# EAGLE design SAMD11C_Mini_Breakout (EAGLE 9.1.0)
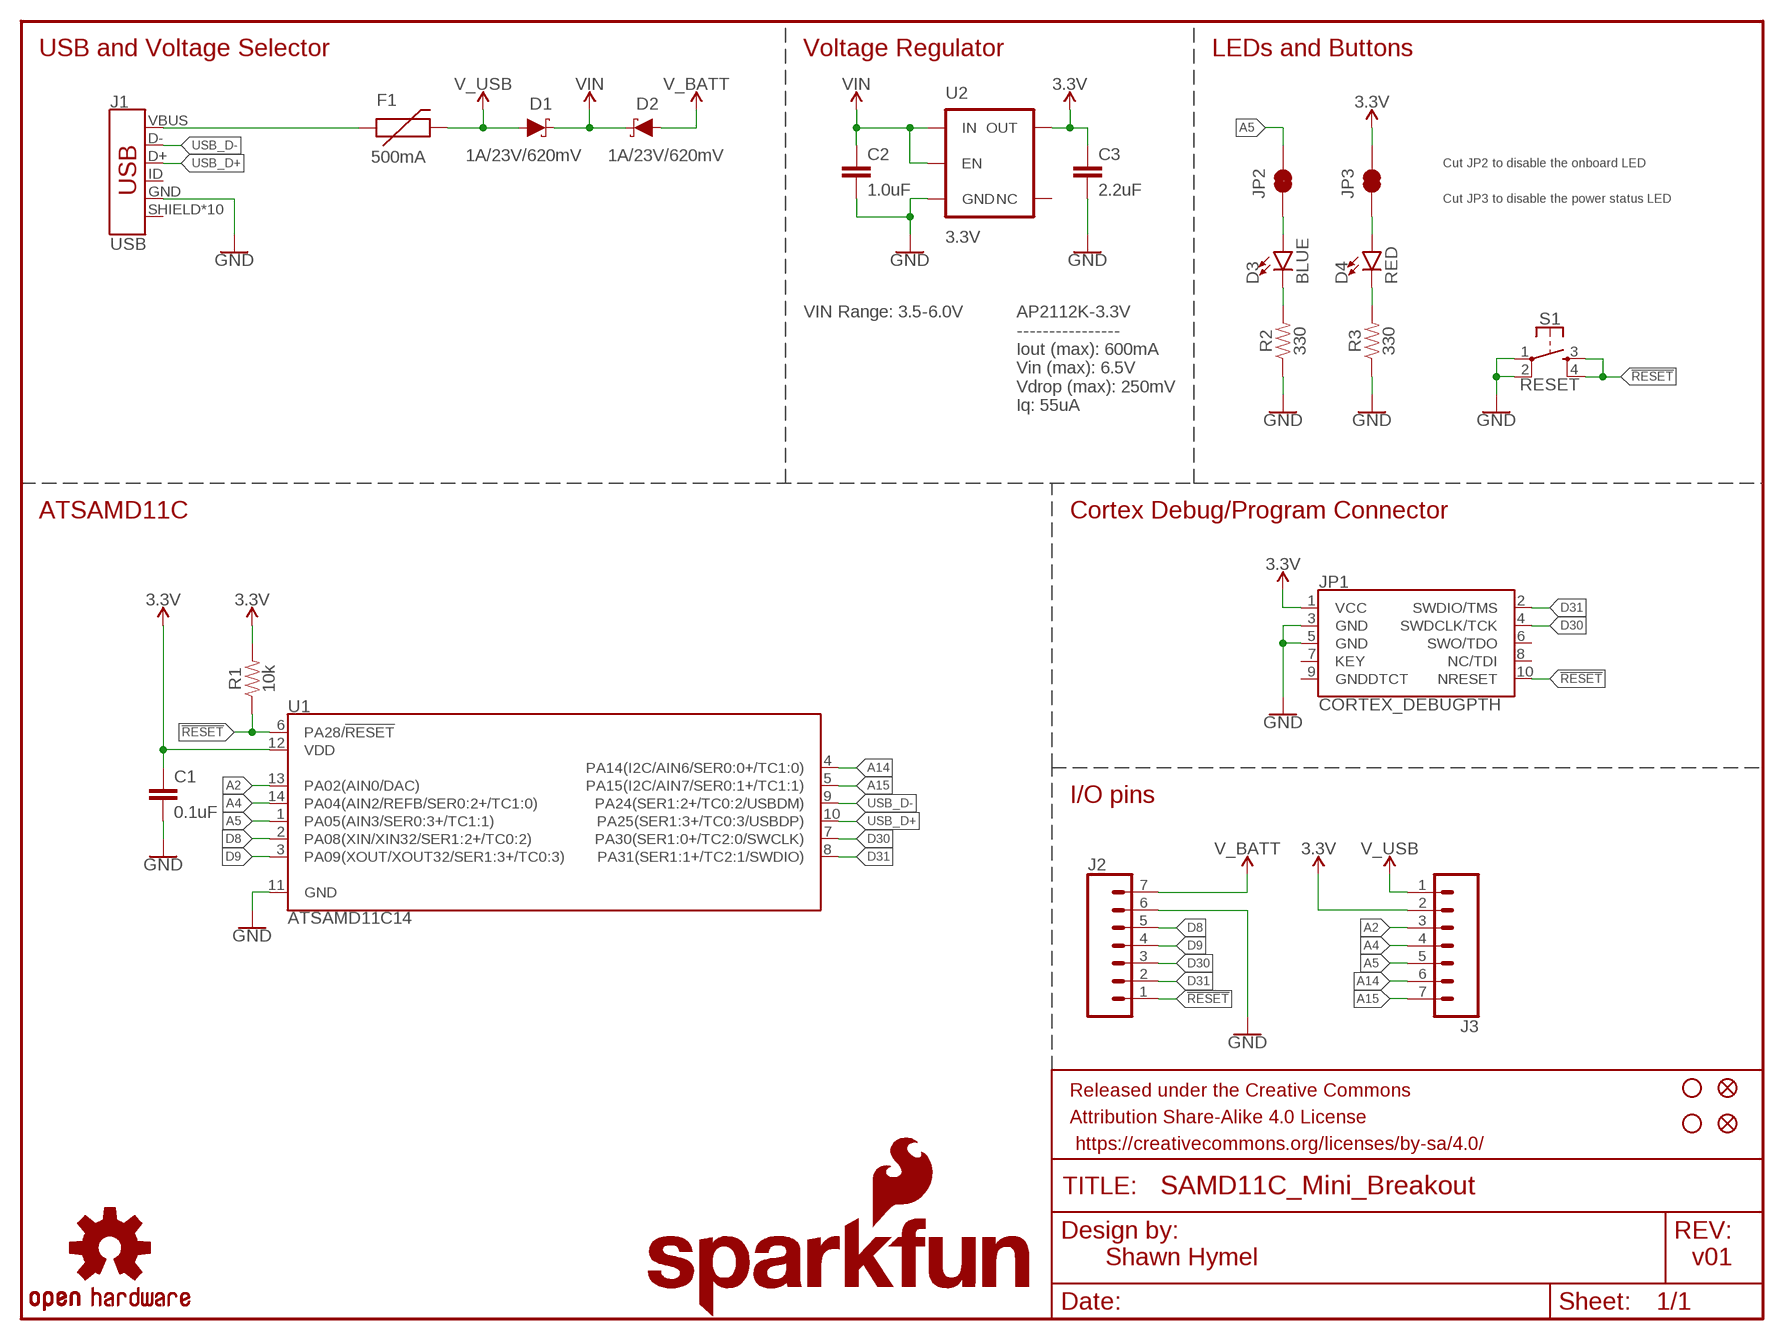
[diagram p0: schematic, sheet 1]

## Parts
C1  0.1uF  0.1UF-0603-25V-(+80/-20%)  [0603]
C2  1.0uF  1.0UF-0805-25V-(+80/-20%)  [0805]
C3  2.2uF  2.2UF-0603-10V-20%  [0603]
D1  1A/23V/620mV  DIODE-SCHOTTKY-BAT20J  [SOD-323]
D2  1A/23V/620mV  DIODE-SCHOTTKY-BAT20J  [SOD-323]
D3  BLUE  LED-BLUE0603  [LED-0603]
D4  RED  LED-RED0603  [LED-0603]
F1  500mA  PTCSMD  [PTC-1206]
FD1  FIDUCIAL1X2  [FIDUCIAL-1X2]
FD2  FIDUCIAL1X2  [FIDUCIAL-1X2]
FRAME1  FRAME-LETTER  [CREATIVE_COMMONS]
FRAME2  FRAME-LETTER  [CREATIVE_COMMONS]
H3  STAND-OFF  [STAND-OFF]
H4  STAND-OFF  [STAND-OFF]
J1  USB  USB_MICRO-B_HALF_PTH_MILL  [USB-MICROB-PTH-MILL]
J2  CONN_07NO_SILK  [1X07_NO_SILK]
J3  CONN_07NO_SILK  [1X07_NO_SILK]
JP1  CORTEX_DEBUGPTH  [2X5-PTH-1.27MM]
JP2  JUMPER-SMT_2_NC_TRACE_NO-SILK  [SMT-JUMPER_2_NC_TRACE_NO-SILK]
JP3  JUMPER-SMT_2_NC_TRACE_NO-SILK  [SMT-JUMPER_2_NC_TRACE_NO-SILK]
LOGO1  OSHW-LOGOS  [OSHW-LOGO-S]
LOGO2  SFE_LOGO_NAME_FLAME.1_INCH  [SFE_LOGO_NAME_FLAME_.1]
LOGO3  SFE_LOGO_FLAME.1_INCH  [SFE_LOGO_FLAME_.1]
R1  10k  10KOHM-0603-1/10W-1%  [0603]
R2  330  330OHM-0603-1/10W-1%  [0603]
R3  330  330OHM-0603-1/10W-1%  [0603]
S1  RESET  MOMENTARY-SWITCH-SPST-2-SMD-4.6X2.8MM  [TACTILE_SWITCH_SMD_4.6X2.8MM]
U1  ATSAMD11C14  [SOIC-14]
U2  3.3V  V_REG_AP2112K-3.3V  [SOT23-5]

## Nets
3.3V: C1.1 C3.1 J3.2 JP1.1(VCC) JP3.2 R1.2 U1.12(VDD) U2.5(OUT)
!RESET: J2.1 JP1.10(NRESET) R1.1 S1.3 S1.4 U1.6(PA28/!RESET!)
A2: J3.3 U1.13(PA02(AIN0/DAC))
A4: J3.4 U1.14(PA04(AIN2/REFB/SER0:2+/TC1:0))
A5: J3.5 JP2.2 U1.1(PA05(AIN3/SER0:3+/TC1:1))
A14: J3.6 U1.4(PA14(I2C/AIN6/SER0:0+/TC1:0))
A15: J3.7 U1.5(PA15(I2C/AIN7/SER0:1+/TC1:1))
D8: J2.5 U1.2(PA08(XIN/XIN32/SER1:2+/TC0:2))
D9: J2.4 U1.3(PA09(XOUT/XOUT32/SER1:3+/TC0:3))
D30: J2.3 JP1.4(SWDCLK/TCK) U1.7(PA30(SER1:0+/TC2:0/SWCLK))
D31: J2.2 JP1.2(SWDIO/TMS) U1.8(PA31(SER1:1+/TC2:1/SWDIO))
GND: C1.2 C2.2 C3.2 J1.GND J2.6 JP1.3(GND) JP1.5(GND) R2.1 R3.1 S1.1 S1.2 U1.11(GND) U2.2(GND)
N$1: D3.A JP2.1
N$2: D3.C R2.2
N$3: D4.A JP3.1
N$4: F1.1 J1.VBUS
N$5: D4.C R3.2
USB_D+: J1.D+ U1.10(PA25(SER1:3+/TC0:3/USBDP))
USB_D-: J1.D- U1.9(PA24(SER1:2+/TC0:2/USBDM))
V_BATT: D2.A J2.7
V_USB: D1.A F1.2 J3.1
VIN: C2.1 D1.C D2.C U2.1(IN) U2.3(EN)
Unconnected: J1.ID J1.SHIELD J1.SHIELD2(SHIELD) J1.SHIELD3(SHIELD) J1.SHIELD4(SHIELD) J1.SHIELD5(SHIELD) J1.SHIELD6(SHIELD) J1.SHIELD7(SHIELD) J1.SHIELD8(SHIELD) J1.SHIELD9(SHIELD) J1.SHIELD10(SHIELD) JP1.6(SWO/TDO) JP1.7(KEY) JP1.8(NC/TDI) JP1.9(GNDDTCT) U2.4(NC)

## Notes on the sheet
- USB and Voltage Selector | Voltage Regulator | LEDs and Buttons
- Cut JP2 to disable the onboard LED
- Cut JP3 to disable the power status LED
- VIN Range: 3.5-6.0V
- AP2112K-3.3V
  ----------------
  Iout (max): 600mA 
  Vin (max): 6.5V
  Vdrop (max): 250mV
  Iq: 55uA
- ATSAMD11C | Cortex Debug/Program Connector
- I/O pins
- Shawn Hymel | v01

## Library data of the parts
C1 = SparkFun-Capacitors:0.1UF: 0.1µF ceramic capacitors A capacitor is a passive two-terminal electrical component used to store electrical energy temporarily in an electric field.; PROD_ID: CAP-00810
C2 = SparkFun-Capacitors:1.0UF: 1µF ceramic capacitors A capacitor is a passive two-terminal electrical component used to store electrical energy temporarily in an electric field.; PROD_ID: CAP-11625
C3 = SparkFun-Capacitors:2.2UF: 2.2µF ceramic capacitors A capacitor is a passive two-terminal electrical component used to store electrical energy temporarily in an electric field.; PROD_ID: CAP-07888
D1 D2 = SparkFun-DiscreteSemi:DIODE-SCHOTTKY: Schottky diode A Schottky diode is a semiconductor diode which has a low forward voltage drop and a very fast switching action.; PROD_ID: DIO-11623
D3 = SparkFun-LED:LED-BLUE: Blue SMD LED Used in manufacturing of various products at SparkFun Packages: 0603 - SMD 0603 package [Product Link] <http://www.digikey.com/product-detail/en/SMLE12BC7TT86/511-1589-2-ND/1641808> 1206 - SMD1206 package [Product Link] <http://www.digikey.com/product-detail/en/lite-on-inc/LTST-C150TBKT/160-1643-1-ND/573584> SparkFun Products: ESP8266 Thing-Dev Board <https://www.sparkfun.com/products/13711> RedBoard <https://www.sparkfun.com/products/12757>; PROD_ID: DIO-08575
D4 = SparkFun-LED:LED-RED: Red SMD LED Used in manufacturing of most products at SparkFun Packages: 0603 - SMD 0603 package [Product Link] <http://docs.avagotech.com/docs/AV02-0551EN> 0603 SMART - SMD 0603 SMART package ( more efficient and expensive)[Product Link] <http://www.osram-os.com/Graphics/XPic2/00077099_0.pdf> 1206 - SMD1206 package [Product Link] <https://www.sparkfun.com/datasheets/DevTools/LilyPad/Q150OVS4.pdff> SparkFun Products: Pro Mini 328 -5V <https://www.sparkfun.com/products/821> RedBoard <https://www.sparkfun.com/products/12757> IOIO-OTG <https://www.sparkfun.com/products/13613>; PROD_ID: DIO-00819
F1 = SparkFun-PowerIC:PTC: Resettable Fuse PTC Resettable Fuse. Spark Fun Electronics SKU : COM-08357; PROD_ID: RES-11150
FD1 FD2 = SparkFun-Aesthetics:FIDUCIAL: Fiducial Alignment Points Point-of-reference for pick-and-place machines and other optical instruments.
FRAME1 FRAME2 = SparkFun-Aesthetics:FRAME-LETTER: Schematic Frame - Letter Standard 8.5x11 US Letter frame
H3 H4 = SparkFun-Hardware:STAND-OFF: Stand Off Drill holes for mechanically mounting via screws, standoffs, etc. Note: Use the keepout ring to avoid running the screw head into surrounding components. Variant Overviews STAND-OFF - Mechanical footprint for a #4 phillips button head screw. STAND-OFF-TIGHT - Mechanical footprint for a #4 phillips button head screw, Example SparkFun Products Screw - Phillips Head (1/4", 4-40, 10 pack) <https://www.sparkfun.com/products/10453> (PRT-10453) Screw - Phillips Head (1/2", 4-40, 10 pack) <https://www.sparkfun.com/products/10452> (PRT-10452) Screw - Phillips Head (3/4", 4-40, 10 pack) <https://www.sparkfun.com/products/10451> (PRT-10451) Screw - Phillips Head (1", 4-40, 10 pack) <https://www.sparkfun.com/products/10450> (PRT-10450)
J1 = SparkFun-Connectors:USB_MICRO-B: USB Type Micro-B Connector Male/female and PTH/SMT variants SparkFun Products: SparkFun microB USB Breakout <https://www.sparkfun.com/products/12035> SparkFun USB microB Plug Breakout <https://www.sparkfun.com/products/10031> SparkFun ESP8266 Thing <https://www.sparkfun.com/products/13231>; PROD_ID: CONN-13711
J2 J3 = SparkFun-Connectors:CONN_07: Multi connection point. Often used as Generic Header-pin footprint for 0.1 inch spaced/style header connections On any of the 0.1 inch spaced packages, you can populate with these: Break Away Headers - Straight <https://www.sparkfun.com/products/116> (PRT-00116) Break Away Male Headers - Right Angle <https://www.sparkfun.com/products/553> (PRT-00553) Female Headers <https://www.sparkfun.com/products/115> (PRT-00115) Break Away Headers - Machine Pin <https://www.sparkfun.com/products/117> (PRT-00117) Break Away Female Headers - Swiss Machine Pin <https://www.sparkfun.com/products/743> (PRT-00743) For SCREWTERMINALS and SPRING TERMINALS visit here: Screw Terimnals on SparkFun.com <https://www.sparkfun.com/search/results?term=Screw+Terminals> (5mm/3.5mm/2.54mm spacing) This device is also useful as a general connection point to wire up your design to another part of your project. Our various solder wires solder well into these plated through hole pads. Hook-Up Wire - Assortment (Stranded, 22 AWG) <https://www.sparkfun.com/products/11375> (PRT-11375) Hook-Up Wire - Assortment (Solid Core, 22 AWG) <https://www.sparkfun.com/products/11367> (PRT-11367) View the entire wire category on our website here <https://www.sparkfun.com/categories/141> Special notes: Molex polarized connector foot print use with SKU : PRT-08231 with associated crimp pins and housings. 1MM SMD Version SKU: PRT-10208 NOTES ON THE VARIANTS LOCK and LOCK_LONGPADS... This footprint was designed to help hold the alignment of a through-hole component (i.e. 6-pin header) while soldering it into place. You may notice that each hole has been shifted either up or down by 0.005 of an inch from it's more standard position (which is a perfectly straight line). This slight alteration caused the pins (the squares in the middle) to touch the edges of the holes. Because they are alternating, it causes a "brace" to hold the component in place. 0.005 has proven to be the perfect amount of "off-center" position when using our standard breakaway headers. Although looks a little odd when you look at the bare footprint, once you have a header in there, the alteration is very hard to notice. Also,if you push a header all the way into place, it is covered up entirely on the bottom side.
JP1 = samd21-temp:CORTEX_DEBUG: Cortex Debug Connector Datasheet <http://infocenter.arm.com/help/topic/com.arm.doc.faqs/attached/13634/cortex_debug_connectors.pdf>
JP2 JP3 = SparkFun-Jumpers:JUMPER-SMT_2_NC_TRACE: Normally closed trace jumper This jumper has a trace between two pads so it's normally closed (NC). Use a razor knife to open the connection. For best results follow the IPC guidelines for cutting traces: Cutout at least 0.063 mm (0.005 in). Remove all loose material to clean up the cut area. Seal the cut with an approved epoxy. Reapply solder to reclose the connection.
LOGO1 = SparkFun-Aesthetics:OSHW-LOGO: Open-Source Hardware (OSHW) Logo This logo indicates the piece of hardware it is found on incorporates a OSHW license and/or adheres to the definition of open source hardware found here: http://freedomdefined.org/OSHW
LOGO2 = SparkFun-Aesthetics:SFE_LOGO_NAME_FLAME: SparkFun Font Logo w/ Flame This is the SparkFun full logo. The logo on the schematic will always be the same size; the package variant is the height of the flame part of the logo. Default layer for the logo on the board is tSilk.
LOGO3 = SparkFun-Aesthetics:SFE_LOGO_FLAME: SparkFun Flame Logo This is the SparkFun flame logo. The logo on the schematic will always be the same size; the package variant is the height of the flame. Default layer for the logo on the board is tSilk.
R1 = SparkFun-Resistors:10KOHM: 10kΩ resistor A resistor is a passive two-terminal electrical component that implements electrical resistance as a circuit element. Resistors act to reduce current flow, and, at the same time, act to lower voltage levels within circuits. - Wikipedia; PROD_ID: RES-00824
R2 R3 = SparkFun-Resistors:330OHM: 330Ω resistor A resistor is a passive two-terminal electrical component that implements electrical resistance as a circuit element. Resistors act to reduce current flow, and, at the same time, act to lower voltage levels within circuits. - Wikipedia; PROD_ID: RES-00818
S1 = SparkFun-Switches:MOMENTARY-SWITCH-SPST-2: Momentary Switch (Pushbutton) - SPST - Two Circuits Normally-open (NO) SPST momentary switches (buttons, pushbuttons). Schematic symbol includes two switch circuits. Variants SMD-4.6MMX2.8MM - 4.60mm x 2.80mm Tactile Momentary Button Switch - Used on SparkFun SAMD21 Mini Breakout <https://www.sparkfun.com/products/13664> SMD-5.2MM - Mini Pushbutton Switch - SMD <https://www.sparkfun.com/products/8720> - Used on Arduino Pro Mini <https://www.sparkfun.com/products/11114>; PROD_ID: SWCH-13065
U1 = SAMD11C14_Mini_Breakout:ATSAMD11C14: Atmel SAM D11 SMART ARM-Based Microcontroller The Atmel® | SMART™ SAM D11 is a series of low-power microcontrollers using the 32-bit ARM® Cortex®-M0+ processor, and ranging from 14- to 24-pins with 16KB Flash and 4KB of SRAM. The SAM D11 devices operate at a maximum frequency of 48MHz and reach 2.46 Coremark/MHz. They are designed for simple and intuitive migration with identical peripheral modules, hex compatible code, identical linear address map and pin compatible migration paths between all devices in the product series. All devices include intelligent and flexible peripherals, Atmel Event System for inter-peripheral signaling, and support for capacitive touch button, slider and wheel user interfaces. The SAM D11 series is compatible to the other product series in the SAM D family, enabling easy migration to larger device with added features.
U2 = SparkFun-PowerIC:V_REG_AP2112: AP2112 - 600mA CMOS LDO Regulator w/ Enable The AP2112 is CMOS process low dropout linear regulator with enable function, the regulator delivers a guaranteed 600mA (min.) continuous load current. Features Output Voltage Accuracy: ±1.5% Output Current: 600mA (Min.) Foldback Short Current Protection: 50mA Enable Function to Turn ON/OFF VOUT Low Dropout Voltage (3.3V): 250mV (Typ.) @IOUT=600mA Excellent Load Regulation: 0.2%/A (Typ.) Excellent Line Regulation: 0.02%/V (Typ.) Low Quiescent Current: 55μA (Typ.) Low Standby Current: 0.01μA (Typ.) Low Output Noise: 50μVRMS PSRR: 100Hz -65dB, 1kHz -65dB OTSD Protection Stable with 1.0μF Flexible Cap: Ceramic, Tantalum and Aluminum Electrolytic Operation Temperature Range: -40°C to 85°C ESD: MM 400V, HBM 4000V; PROD_ID: VREG-12457

## Board
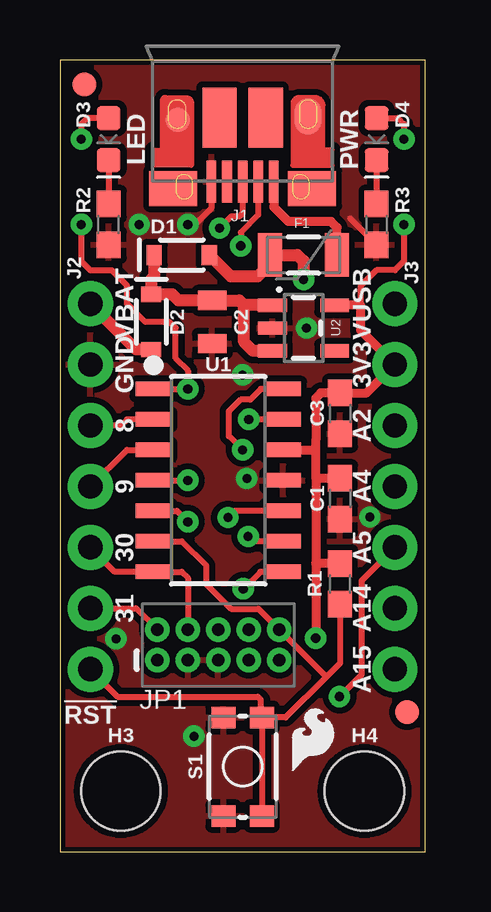
[diagram p1: board, top side]
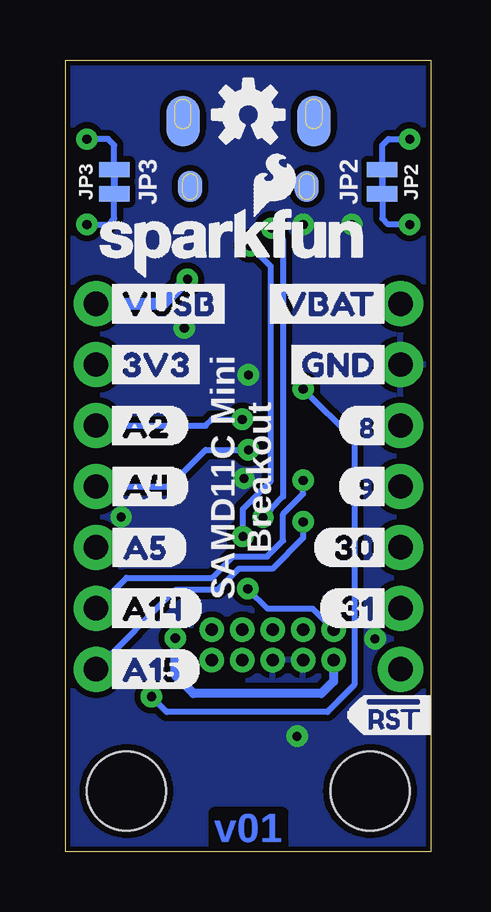
[diagram p2: board, bottom side, seen from below]

Size 15.24 x 33.02 mm. Coordinates in mm from the lower left corner, seen from the top.
Outline: 0,0 15.24,0 15.24,33.02 0,33.02 0,0
Copper layers (1*16): Top 0.035mm / dielectric 1.5mm / Bottom 0.035mm
Design rules "SparkFun-2-layer-STANDARD": minimum track width 10mil, minimum drill 20mil, track to track 10mil, track to pad 8mil, pad to pad 8mil, via to via 10mil, smd to smd 8mil, copper to edge 8mil, drill to drill 8mil, minimum pad ring 10mil, minimum via ring 10mil, stop-mask expansion 4mil, vias tented up to drill 25mil, thermal gap 10mil

### Footprints (pad centres in the part's own frame; a part is rotated, then mirrored left to right if it is on the bottom)
0603 = smd 1.1 x 1: 1 -0.85,0; 2 0.85,0
0805 = smd 0.8 x 1.2: 1 -0.9,0; 2 0.9,0
SOD-323 = smd 0.63 x 0.83: A 1.15,0; C -1.15,0
LED-0603 = smd 1 x 1: A -0.877,0; C 0.877,0
PTC-1206 = smd 1 x 1.8: 1 -1.4,0; 2 1.4,0
FIDUCIAL-1X2 = smd 1 x 1: 1 0,0
STAND-OFF = hole 3.302: 0,0
USB-MICROB-PTH-MILL = smd 0.4 x 1.75: D+ 0,0; D- -0.65,0; GND 1.3,0; ID 0.65,0; VBUS -1.3,0 | smd 2 x 1.46: SHIELD -2.9,0.275; SHIELD2 2.9,0.275 | smd 1.425 x 2.5: SHIELD3 -0.963,-2.675; SHIELD4 0.963,-2.675 | smd 1.4 x 2.1 bottom: SHIELD5 -2.731,-2.531; SHIELD7 2.729,-2.531 | smd 1 x 1: SHIELD6 2.7,-2.575 | smd 1.1 x 1.5: SHIELD8 -2.731,-2.731 | smd 1 x 1.3 bottom: SHIELD9 -2.43,0.195; SHIELD10 2.43,0.195
1X07_NO_SILK = drill 1.016 pad 1.88: 1 0,0; 2 2.54,0; 3 5.08,0; 4 7.62,0; 5 10.16,0; 6 12.7,0; 7 15.24,0
2X5-PTH-1.27MM = drill 0.508 pad 1: 1 -2.54,-0.635; 2 -2.54,0.635; 3 -1.27,-0.635; 4 -1.27,0.635; 5 0,-0.635; 6 0,0.635; 7 1.27,-0.635; 8 1.27,0.635; 9 2.54,-0.635; 10 2.54,0.635
SMT-JUMPER_2_NC_TRACE_NO-SILK = smd 0.635 x 1.27: 1 -0.508,0; 2 0.508,0
TACTILE_SWITCH_SMD_4.6X2.8MM = smd 0.9 x 1: 1 -2.05,-0.8; 2 2.05,-0.8; 3 2.05,0.8; 4 -2.05,0.8
SOIC-14 = smd 0.6 x 1.5: 1 -3.81,-2.7; 2 -2.54,-2.7; 3 -1.27,-2.7; 4 0,-2.7; 5 1.27,-2.7; 6 2.54,-2.7; 7 3.81,-2.7; 8 3.81,2.7; 9 2.54,2.7; 10 1.27,2.7; 11 0,2.7; 12 -1.27,2.7; 13 -2.54,2.7; 14 -3.81,2.7
SOT23-5 = smd 0.55 x 1.2: 1 -0.95,-1.3; 2 0,-1.3; 3 0.95,-1.3; 4 0.95,1.3; 5 -0.95,1.3

### Placement (x,y rotation side)
C1  11.68,14.73 270 top
C2  6.35,22.1 270 top
C3  11.68,18.29 270 top
D1  5.08,24.89 0 top
D2  3.81,22.1 270 top
D3  2.03,29.72 270 top
D4  13.21,29.72 270 top
F1  10.16,24.89 180 top
FD1  14.48,5.84 0 top
FD2  1.02,32 0 top
FRAME1  -17.53,-11.18 0 top  (outside the outline)
FRAME2  -17.53,-11.18 0 top  (outside the outline)
H3  2.54,2.54 0 top
H4  12.7,2.54 0 top
J1  7.62,27.94 180 top
J2  1.27,7.62 90 top
J3  13.97,22.86 270 top
JP1  6.6,8.64 0 top
JP2  2.03,27.94 270 bottom
JP3  13.21,27.94 270 bottom
LOGO1  7.62,30.73 0 bottom
LOGO2  14.22,23.88 0 bottom
LOGO3  9.4,3.05 0 top
R1  11.68,11.18 90 top
R2  2.03,26.16 90 top
R3  13.21,26.16 90 top
S1  7.62,3.56 270 top
U1  6.6,15.49 270 top
U2  10.16,21.84 270 top
U$1  [#RST4]  3.73,5.71 0 bottom
U$2  [3V33]  13.82,20.32 0 bottom
U$3  [85]  3.94,17.78 0 bottom
U$4  [96]  4.06,15.24 0 bottom
U$5  [307]  4.98,12.7 0 bottom
U$6  [318]  4.7,10.16 0 bottom
U$7  [A29]  13.82,17.78 0 bottom
U$8  [A410]  13.77,15.24 0 bottom
U$9  [A511]  13.77,12.7 0 bottom
U$10  [A1412]  13.82,10.16 0 bottom
U$11  [A1513]  13.82,7.62 0 bottom
U$12  [GND1]  6.3,20.32 0 bottom
U$13  [VBAT0]  7.19,22.86 0 bottom
U$14  [VUSB2]  13.82,22.86 0 bottom

### Tracks (layer width: path | path; a pad name or v marks a point on that pad's centre or on a via)
3.3V  (via drill 0.38)
  Top 0.254: v14.35,26.16 14.35,24.64 13.97,24.26 13.21,24.26 12.54,23.59 12.54,22.79
  Top 0.381: 10.67,16.76 10.67,17.17 10.67,18.92 10.88,19.14 C3.1 12.79,19.14 J3.2 12.55,21.74 12.55,22.78 12.54,22.79 U2.5 | U1.12 10.67,16.76 | 10.67,15.6 10.67,16.76 | C1.1 10.68,15.58 10.67,15.6 | 10.67,15.6 10.67,12.04 10.68,12.03 | R1.2 10.68,12.03 | 10.68,12.03 10.67,12.01 v10.67,8.91
  Bottom 0.254: v14.35,26.16 13.46,26.16 13.21,26.42 JP3.2
  Bottom 0.381: JP1.1 4.06,7.11 4.57,6.6 9.91,6.6 10.67,7.37 v10.67,8.91
!RESET
  Top 0.254: S1.4 9.42,5.61 11.11,7.3 | S1.4 S1.3 | U1.6 5.08,12.95 6.1,11.94 6.1,11.18 7.14,10.13 8.28,10.13 JP1.10 11.11,7.3 | 11.11,7.3 11.68,7.87 R1.1 | J2.1 2.41,6.48 8.26,6.48 8.38,6.35 8.38,5.64 S1.4
A2  (via drill 0.38)
  Top 0.254: U1.13 v7.87,18.03
  Bottom 0.254: J3.3 9.4,17.78 9.14,18.03 v7.87,18.03
A4  (via drill 0.38)
  Top 0.254: U1.14 8.38,19.3 7.94,18.86 7.53,18.86 7.05,18.38 7.05,17.34 v7.62,16.76
  Bottom 0.254: J3.4 10.92,15.24 9.4,16.76 v7.62,16.76
A5  (via drill 0.38)
  Top 0.254: U1.1 v5.33,19.3 5.33,20.07 4.83,20.57 4.83,21.84 4.57,22.1 3.56,22.1 2.79,22.86 2.79,23.62 2.16,24.26 1.27,24.26 0.89,24.64 v0.89,26.16 | J3.5 12.57,11.3 12.57,7.39 v11.66,6.48
  Bottom 0.254: v5.33,19.3 3.2,17.17 3.2,6.96 4.32,5.84 11.02,5.84 v11.66,6.48 | v0.89,26.16 1.78,26.16 2.03,26.42 JP2.2
A14  (via drill 0.38)
  Top 0.254: U1.4 v5.33,15.49
  Bottom 0.254: J3.6 12.7,11.43 9.14,11.43 8.26,12.32 6.83,12.32 6.17,12.98 6.17,14.1 5.33,14.94 v5.33,15.49
A15  (via drill 0.38)
  Top 0.254: U1.5 4.88,14.22 v5.33,13.77
  Bottom 0.254: J3.7 10.67,10.92 8.91,10.92 8.03,11.81 6.62,11.81 5.33,13.1 v5.33,13.77
D8
  Top 0.254: U1.2 2.79,18.03 2.54,17.78 J2.5
D9
  Top 0.254: J2.4 2.79,16.76 U1.3
D30
  Top 0.254: JP1.4 5.33,11.43 5.08,11.68 U1.7 2.29,11.68 J2.3
D31  (via drill 0.38)
  Top 0.254: J2.2 3.17,10.16 JP1.2 | U1.8 8.36,11.68 v7.64,10.97
  Bottom 0.254: JP1.2 4.93,10.13 6.81,10.13 v7.64,10.97
GND  (via drill 0.38)
  Top 0.254: J1.GND 6.32,26.84 5.64,26.16 v5.33,26.16 | R3.1 12.1,26.42
  other vias: 7.8,15.57 7.62,19.89 10.29,21.84 3.3,26.16 5.59,4.83 2.34,8.89 12.93,13.97
  pour Bottom: 0,33.02 15.24,33.02 15.24,0 0,0
  pour Top: 0,33.02 15.24,33.02 15.24,0 0,0
N$1  (via drill 0.38)
  Top 0.254: D3.A 1.13,30.59 0.89,30.35 v0.89,29.72
  Bottom 0.254: JP2.1 2.03,29.46 1.78,29.72 v0.89,29.72
N$2
  Top 0.254: D3.C R2.2
N$3  (via drill 0.38)
  Top 0.254: D4.A 14.11,30.59 14.35,30.35 v14.35,29.72
  Bottom 0.254: JP3.1 13.21,29.46 13.46,29.72 v14.35,29.72
N$4
  Top 0.381: J1.VBUS 8.92,26.89 9.53,26.29 11.3,26.29 11.56,26.03 F1.1
N$5
  Top 0.254: D4.C R3.2
USB_D+  (via drill 0.38)
  Top 0.254: v6.66,26.01 7.14,26.49 7.49,26.49 7.62,26.63 J1.D+ | v7.01,13.95 7.29,14.22 U1.10
  Bottom 0.254: v6.66,26.01 6.17,25.53 6.17,15.46 6.17,14.81 6.68,14.31 6.68,14.28 v7.01,13.95
USB_D-  (via drill 0.38)
  Top 0.254: v7.54,25.27 7.54,25.83 8.27,26.56 J1.D- | U1.9 8.05,12.95 v7.85,13.16
  Bottom 0.254: v7.54,25.27 6.68,24.41 6.68,15.47 7.85,14.3 v7.85,13.16
V_BATT
  Top 0.508: D2.A 3.18,20.95 J2.7
V_USB  (via drill 0.38)
  Top 0.508: D1.A 7.12,24 8.26,24 8.76,24.51 F1.2 9.91,24.89 10.16,24.64 v10.16,23.88
  Bottom 0.508: v10.16,23.88 11.18,22.86 J3.1
VIN
  Top 0.508: D1.C 3.93,24 3.81,23.88 D2.C 4.69,23.25 4.94,23 C2.1 7.48,23 7.69,22.79 | U2.1 7.69,22.79 | 7.69,22.79 7.69,21.27 8.06,20.89 U2.3

### Text on the board
Bottom: v01
tPlace: LED | PWR | VBAT | VUSB | GND | 3V3 | 8 | A2 | 9 | A4 | 30 | A5 | 31 | A14 | A15 | !RST
bPlace: JP2 | JP3 | SAMD11C Mini / Breakout
tDocu: Shawn Hymel